# Altium schematic sheet Order.schdoc
size 508 x 304 mm
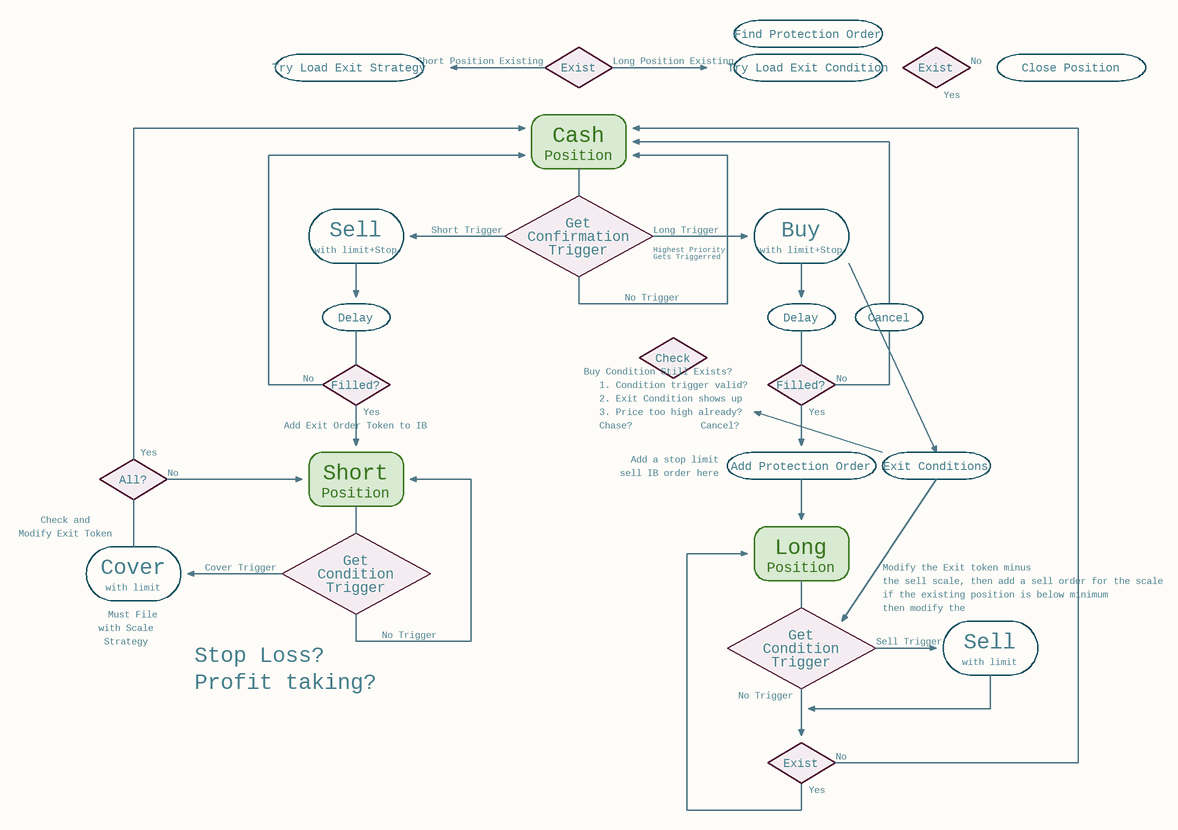
[diagram p0: Order.schdoc]

## Notes on the sheet
- Find Protection Order
- Try Load Exit Strategy
- Short Position Existing
- Exist
- Long Position Existing
- Try Load Exit Condition
- Yes
- No
- Close Position
- Cash
- Position
- Sell
- Short Trigger
- Confirmation
- Get
- Long Trigger
- Buy
- with limit+Stop
- Trigger
- No Trigger
- Highest Priority
- Gets Triggerred
- Delay
- Check
- Buy Condition Still Exists?
- Cancel
- Filled?
- Add Exit Order Token to IB
- 1. Condition trigger valid?
- Chase?
- 2. Exit Condition shows up
- 3. Price too high already?
- Cancel?
- All?
- Short
- Add a stop limit
- sell IB order here
- Add Protection Order
- Exit Conditions
- Modify Exit Token
- Check and
- Cover
- Cover Trigger
- Condition
- Long
- Modify the Exit token minus
- the sell scale, then add a sell order for the scale
- with Scale
- Strategy
- with limit
- Must File
- Sell Trigger
- if the existing position is below minimum
- then modify the
- Stop Loss?
- Profit taking?